# Altium schematic sheet PT_Connetions.SchDoc
size Letter
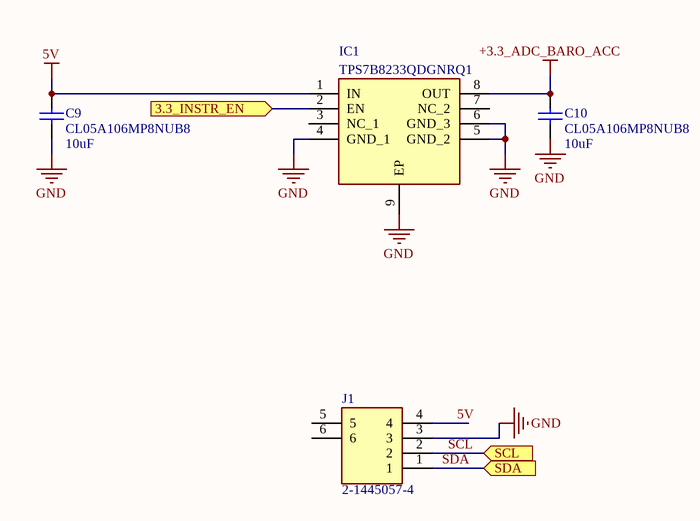
[diagram p0: PT_Connetions.SchDoc]

## Parts
C9  CL05A106MP8NUB8  value 10uF  [0402]
C10  CL05A106MP8NUB8  value 10uF  [0402]
IC1  TPS7B8233QDGNRQ1  [SOP65P490X110-9N]
J1  2-1445057-4  [214450574]

## Ports
3.3_INSTR_EN (in), SCL (in), SDA (in)

## Nets
5V: C9.2 IC1.1(IN) J1.4
+3.3_ADC_BARO_ACC: C10.2 IC1.8(OUT)
GND: C9.1 C10.1 IC1.4(GND_1) IC1.5(GND_2) IC1.6(GND_3) IC1.9(EP) J1.3
3.3_INSTR_EN: IC1.2(EN) ; port 3.3_INSTR_EN
SCL: J1.2 ; port SCL
SDA: J1.1 ; port SDA

Not connected (* = marked no-connect by the designer): IC1 3(NC_1) 7(NC_2); J1 5 6

## Notes on the sheet
- Title
- Size:
- Date:
- Letter
- Number:
- Time:
- Revision:
- Sheet
- of
- Rocket Propulsion Laboratory
- UC San Diego
- Avionics Team
- Author :
- File:

## Library data of the parts
C9 C10 = Cap: Capacitor; Published: 8-Jun-2000; LatestRevisionDate: 17-Jul-2002; LatestRevisionNote: Re-released for DXP Platform.; PackageReference: RAD-0.3; Publisher: Altium Limited; PackageDescription: Radial Cap, Thru-Hole; 2 Leads; 0.3 in Pin Spacing
IC1 = TPS7B8233QDGNRQ1: Integrated Circuit; Manufacturer_Name: Texas Instruments; Datasheet Link: http://www.ti.com/lit/gpn/tps7b82-q1; Height: 1.1mm; Manufacturer_Part_Number: TPS7B8233QDGNRQ1; Arrow Part Number: TPS7B8233QDGNRQ1; Arrow Price/Stock: https://www.arrow.com/en/products/tps7b8233qdgnrq1/texas-instruments; Mouser Part Number: 595-TPS7B8233QDGNRQ1; Mouser Price/Stock: https://www.mouser.co.uk/ProductDetail/Texas-Instruments/TPS7B8233QDGNRQ1?qs=gTYE2QTfZfTgserf%2FHg6KA%3D%3D
J1 = 2-1445057-4: Connector; Manufacturer_Name: TE Connectivity; Datasheet Link: http://www.te.com/commerce/DocumentDelivery/DDEController?Action=showdoc&DocId=Customer+Drawing%7F1445057%7FC3%7Fpdf%7FEnglish%7FENG_CD_1445057_C3.pdf%7F2-1445057-4; Height: 3mm; Manufacturer_Part_Number: 2-1445057-4; Arrow Part Number: 2-1445057-4; Arrow Price/Stock: https://www.arrow.com/en/products/2-1445057-4/te-connectivity; Mouser Part Number: 571-2-1445057-4; Mouser Price/Stock: https://www.mouser.co.uk/ProductDetail/TE-Connectivity-AMP/2-1445057-4?qs=MP5IOa7hLjUITJfr001xww%3D%3D